# Altium project MiniPTM.PrjPcb
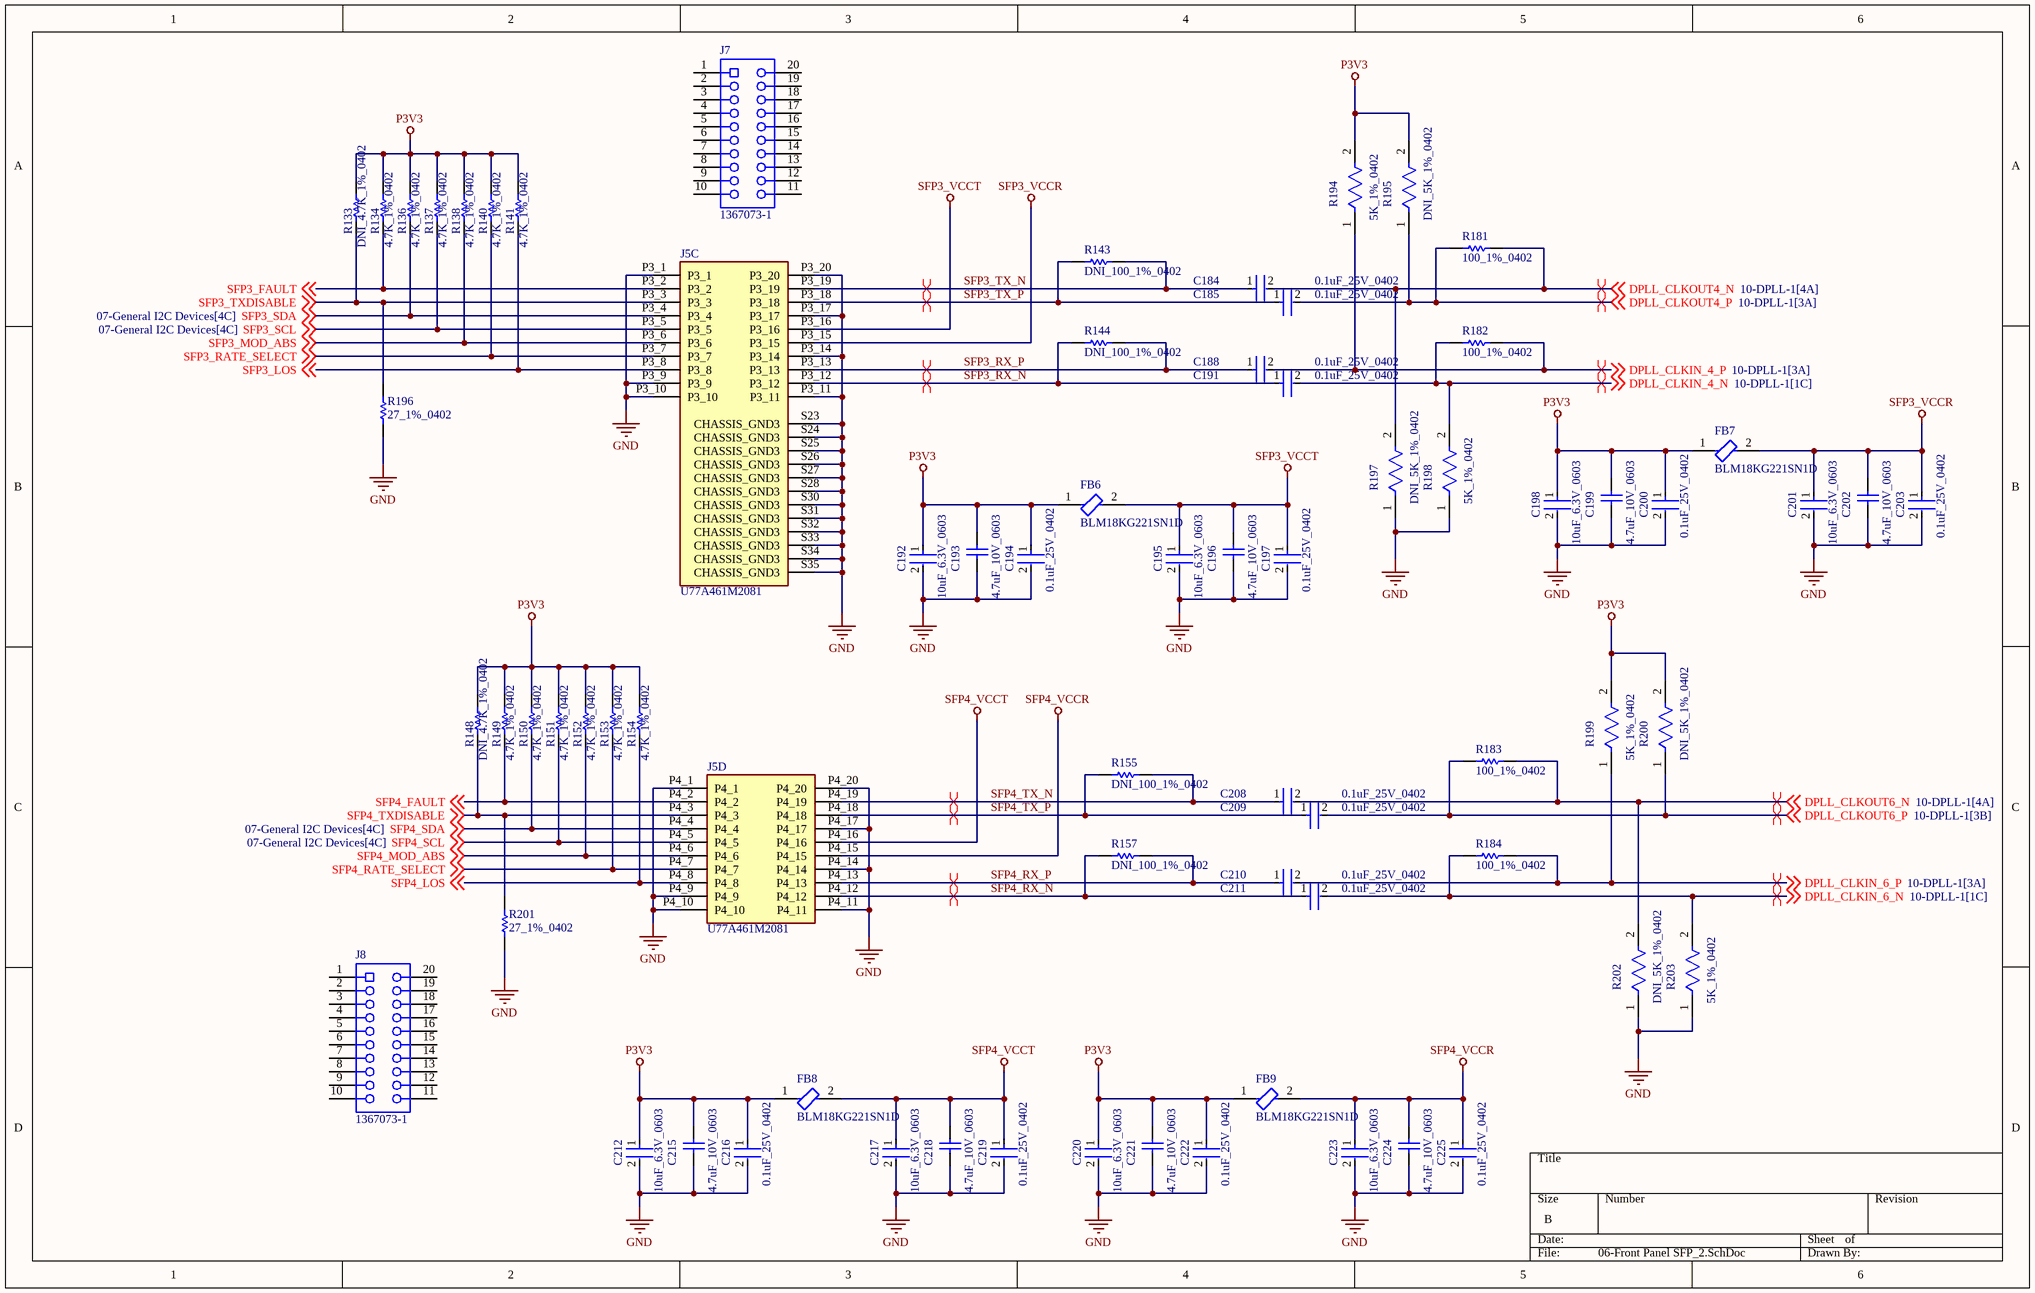
[diagram p0: 06-Front Panel SFP_2.SchDoc]
ProjectDate: 09/14/21; ProjectRevision: P3
3 sheets, 118 parts. Net scope: global (net labels, ports and power ports of the same name join across sheets).
Board file: MiniPTM.PcbDoc
Sheets:
  06-Front Panel SFP_2.SchDoc
  07-General I2C Devices.SchDoc
  13-Power-P3V3.SchDoc

## Sheet 06-Front Panel SFP_2.SchDoc
size B; SheetNumber: 5; SheetTotal: 15

### Parts
C184  0.1uF_25V_0402  [FP-0402-L_1_0_1-W_0_5_0_1-IPC_C]
C185  0.1uF_25V_0402  [FP-0402-L_1_0_1-W_0_5_0_1-IPC_C]
C188  0.1uF_25V_0402  [FP-0402-L_1_0_1-W_0_5_0_1-IPC_C]
C191  0.1uF_25V_0402  [FP-0402-L_1_0_1-W_0_5_0_1-IPC_C]
C192  10uF_6.3V_0603  [FP-C0603C106M9PACTU-MFG]
C193  4.7uF_10V_0603  [CAPC1608X87X35NL15T15]
C194  0.1uF_25V_0402  [FP-0402-L_1_0_1-W_0_5_0_1-IPC_C]
C195  10uF_6.3V_0603  [FP-C0603C106M9PACTU-MFG]
C196  4.7uF_10V_0603  [CAPC1608X87X35NL15T15]
C197  0.1uF_25V_0402  [FP-0402-L_1_0_1-W_0_5_0_1-IPC_C]
C198  10uF_6.3V_0603  [FP-C0603C106M9PACTU-MFG]
C199  4.7uF_10V_0603  [CAPC1608X87X35NL15T15]
C200  0.1uF_25V_0402  [FP-0402-L_1_0_1-W_0_5_0_1-IPC_C]
C201  10uF_6.3V_0603  [FP-C0603C106M9PACTU-MFG]
C202  4.7uF_10V_0603  [CAPC1608X87X35NL15T15]
C203  0.1uF_25V_0402  [FP-0402-L_1_0_1-W_0_5_0_1-IPC_C]
C208  0.1uF_25V_0402  [FP-0402-L_1_0_1-W_0_5_0_1-IPC_C]
C209  0.1uF_25V_0402  [FP-0402-L_1_0_1-W_0_5_0_1-IPC_C]
C210  0.1uF_25V_0402  [FP-0402-L_1_0_1-W_0_5_0_1-IPC_C]
C211  0.1uF_25V_0402  [FP-0402-L_1_0_1-W_0_5_0_1-IPC_C]
C212  10uF_6.3V_0603  [FP-C0603C106M9PACTU-MFG]
C215  4.7uF_10V_0603  [CAPC1608X87X35NL15T15]
C216  0.1uF_25V_0402  [FP-0402-L_1_0_1-W_0_5_0_1-IPC_C]
C217  10uF_6.3V_0603  [FP-C0603C106M9PACTU-MFG]
C218  4.7uF_10V_0603  [CAPC1608X87X35NL15T15]
C219  0.1uF_25V_0402  [FP-0402-L_1_0_1-W_0_5_0_1-IPC_C]
C220  10uF_6.3V_0603  [FP-C0603C106M9PACTU-MFG]
C221  4.7uF_10V_0603  [CAPC1608X87X35NL15T15]
C222  0.1uF_25V_0402  [FP-0402-L_1_0_1-W_0_5_0_1-IPC_C]
C223  10uF_6.3V_0603  [FP-C0603C106M9PACTU-MFG]
C224  4.7uF_10V_0603  [CAPC1608X87X35NL15T15]
C225  0.1uF_25V_0402  [FP-0402-L_1_0_1-W_0_5_0_1-IPC_C]
FB6  BLM18KG221SN1D  [FP-BLM18-0_15-t0_8-IPC_B]
FB7  BLM18KG221SN1D  [FP-BLM18-0_15-t0_8-IPC_B]
FB8  BLM18KG221SN1D  [FP-BLM18-0_15-t0_8-IPC_B]
FB9  BLM18KG221SN1D  [FP-BLM18-0_15-t0_8-IPC_B]
J5  U77A461M2081  [AMPHENOL_U77A461M2081]  (parts C,D of 4)
J7  1367073-1  [TECO-1367073-1_V]
J8  1367073-1  [TECO-1367073-1_V]
R133  DNI_4.7K_1%_0402  [RESC1005X40X25NL10T10]  (no BOM)
R134  4.7K_1%_0402  [RESC1005X40X25NL10T10]
R136  4.7K_1%_0402  [RESC1005X40X25NL10T10]
R137  4.7K_1%_0402  [RESC1005X40X25NL10T10]
R138  4.7K_1%_0402  [RESC1005X40X25NL10T10]
R140  4.7K_1%_0402  [RESC1005X40X25NL10T10]
R141  4.7K_1%_0402  [RESC1005X40X25NL10T10]
R143  DNI_100_1%_0402  [RESC1005X40X25NL05T10]  (no BOM)
R144  DNI_100_1%_0402  [RESC1005X40X25NL05T10]  (no BOM)
R148  DNI_4.7K_1%_0402  [RESC1005X40X25NL10T10]  (no BOM)
R149  4.7K_1%_0402  [RESC1005X40X25NL10T10]
R150  4.7K_1%_0402  [RESC1005X40X25NL10T10]
R151  4.7K_1%_0402  [RESC1005X40X25NL10T10]
R152  4.7K_1%_0402  [RESC1005X40X25NL10T10]
R153  4.7K_1%_0402  [RESC1005X40X25NL10T10]
R154  4.7K_1%_0402  [RESC1005X40X25NL10T10]
R155  DNI_100_1%_0402  [RESC1005X40X25NL05T10]  (no BOM)
R157  DNI_100_1%_0402  [RESC1005X40X25NL05T10]  (no BOM)
R181  100_1%_0402  [RESC1005X40X25NL05T10]
R182  100_1%_0402  [RESC1005X40X25NL05T10]
R183  100_1%_0402  [RESC1005X40X25NL05T10]
R184  100_1%_0402  [RESC1005X40X25NL05T10]
R194  5K_1%_0402  [FP-RC0402-MFG]
R195  DNI_5K_1%_0402  [FP-RC0402-MFG]  (no BOM)
R196  27_1%_0402  [RESC1005X40X25NL05T05]
R197  DNI_5K_1%_0402  [FP-RC0402-MFG]  (no BOM)
R198  5K_1%_0402  [FP-RC0402-MFG]
R199  5K_1%_0402  [FP-RC0402-MFG]
R200  DNI_5K_1%_0402  [FP-RC0402-MFG]  (no BOM)
R201  27_1%_0402  [RESC1005X40X25NL05T05]
R202  DNI_5K_1%_0402  [FP-RC0402-MFG]  (no BOM)
R203  5K_1%_0402  [FP-RC0402-MFG]

### Nets
GND: C192.2 C193.1 C194.2 C195.2 C196.1 C197.2 C198.2 C199.1 C200.2 C201.2 C202.1 C203.2 C212.2 C215.1 C216.2 C217.2 C218.1 C219.2 C220.2 C221.1 C222.2 C223.2 C224.1 C225.2 J5.P3_1 J5.P3_9 J5.P3_10 J5.P3_11 J5.P3_14 J5.P3_17 J5.P3_20 J5.P4_1 J5.P4_9 J5.P4_10 J5.P4_11 J5.P4_14 J5.P4_17 J5.P4_20 J5.S23(CHASSIS_GND3) J5.S24(CHASSIS_GND3) J5.S25(CHASSIS_GND3) J5.S26(CHASSIS_GND3) J5.S27(CHASSIS_GND3) J5.S28(CHASSIS_GND3) J5.S30(CHASSIS_GND3) J5.S31(CHASSIS_GND3) J5.S32(CHASSIS_GND3) J5.S33(CHASSIS_GND3) J5.S34(CHASSIS_GND3) J5.S35(CHASSIS_GND3) R196.1 R197.1 R198.1 R201.1 R202.1 R203.1
P3V3: C192.1 C193.2 C194.1 C198.1 C199.2 C200.1 C212.1 C215.2 C216.1 C220.1 C221.2 C222.1 FB6.1 FB7.1 FB8.1 FB9.1 R133.1 R134.1 R136.1 R137.1 R138.1 R140.1 R141.1 R148.1 R149.1 R150.1 R151.1 R152.1 R153.1 R154.1 R194.2 R195.2 R199.2 R200.2
SFP3_VCCR: C201.1 C202.2 C203.1 FB7.2 J5.P3_15
SFP3_VCCT: C195.1 C196.2 C197.1 FB6.2 J5.P3_16
SFP4_VCCR: C223.1 C224.2 C225.1 FB9.2 J5.P4_15
SFP4_VCCT: C217.1 C218.2 C219.1 FB8.2 J5.P4_16
DPLL_CLKIN_4_N: C191.2 R182.1 R198.2 ; off-sheet DPLL_CLKIN_4_N
DPLL_CLKIN_4_P: C188.2 R182.2 R194.1 ; off-sheet DPLL_CLKIN_4_P
DPLL_CLKIN_6_N: C211.2 R184.1 R203.2 ; off-sheet DPLL_CLKIN_6_N
DPLL_CLKIN_6_P: C210.2 R184.2 R199.1 ; off-sheet DPLL_CLKIN_6_P
DPLL_CLKOUT4_N: C184.2 R181.2 R197.2 ; off-sheet DPLL_CLKOUT4_N
DPLL_CLKOUT4_P: C185.2 R181.1 R195.1 ; off-sheet DPLL_CLKOUT4_P
DPLL_CLKOUT6_N: C208.2 R183.2 R202.2 ; off-sheet DPLL_CLKOUT6_N
DPLL_CLKOUT6_P: C209.2 R183.1 R200.1 ; off-sheet DPLL_CLKOUT6_P
SFP3_FAULT: J5.P3_2 R134.2 ; off-sheet SFP3_FAULT
SFP3_LOS: J5.P3_8 R141.2 ; off-sheet SFP3_LOS
SFP3_MOD_ABS: J5.P3_6 R138.2 ; off-sheet SFP3_MOD_ABS
SFP3_RATE_SELECT: J5.P3_7 R140.2 ; off-sheet SFP3_RATE_SELECT
SFP3_RX_N: C191.1 J5.P3_12 R144.1
SFP3_RX_P: C188.1 J5.P3_13 R144.2
SFP3_SCL: J5.P3_5 R137.2 ; off-sheet SFP3_SCL
SFP3_SDA: J5.P3_4 R136.2 ; off-sheet SFP3_SDA
SFP3_TX_N: C184.1 J5.P3_19 R143.2
SFP3_TX_P: C185.1 J5.P3_18 R143.1
SFP3_TXDISABLE: J5.P3_3 R133.2 R196.2 ; off-sheet SFP3_TXDISABLE
SFP4_FAULT: J5.P4_2 R149.2 ; off-sheet SFP4_FAULT
SFP4_LOS: J5.P4_8 R154.2 ; off-sheet SFP4_LOS
SFP4_MOD_ABS: J5.P4_6 R152.2 ; off-sheet SFP4_MOD_ABS
SFP4_RATE_SELECT: J5.P4_7 R153.2 ; off-sheet SFP4_RATE_SELECT
SFP4_RX_N: C211.1 J5.P4_12 R157.1
SFP4_RX_P: C210.1 J5.P4_13 R157.2
SFP4_SCL: J5.P4_5 R151.2 ; off-sheet SFP4_SCL
SFP4_SDA: J5.P4_4 R150.2 ; off-sheet SFP4_SDA
SFP4_TX_N: C208.1 J5.P4_19 R155.2
SFP4_TX_P: C209.1 J5.P4_18 R155.1
SFP4_TXDISABLE: J5.P4_3 R148.2 R201.2 ; off-sheet SFP4_TXDISABLE

Not connected (* = marked no-connect by the designer): J7 1 2 3 4 5 6 7 8 9 10 11 12 13 14 15 16 17 18 19 20; J8 1 2 3 4 5 6 7 8 9 10 11 12 13 14 15 16 17 18 19 20

### Layout directives
differential pair: DPLL_CLKIN_4_N, DPLL_CLKIN_4_P, DPLL_CLKIN_6_N, DPLL_CLKIN_6_P, DPLL_CLKOUT4_N, DPLL_CLKOUT4_P, DPLL_CLKOUT6_N, DPLL_CLKOUT6_P, SFP3_RX_N, SFP3_RX_P, SFP3_TX_N, SFP3_TX_P, SFP4_RX_N, SFP4_RX_P, SFP4_TX_N, SFP4_TX_P

### Library data of the parts
C184 C185 C188 C191 C194 C197 C200 C203 C208-C211 C216 C219 C222 C225 = CMP-2008-02519-2: General Purpose Ceramic Capacitor, 0402, 100nF, 10%, X7R, 15%, 25V; Package Quantity: 1; Capacitance: 100nF; Min Operating Temperature: -55°C; Voltage: 25V; Voltage Rating: 25V; Construction: Flat; Max Operating Temperature: 125°C; Radiation Hardening: No; Depth: 0.5mm; Thickness: 0.022inch; Voltage Rating (DC): 25V; Number of Pins: 2; Lead Free: Lead Free; Series: -; REACH SVHC: No SVHC; Length: 1mm; Dielectric: X7R; RoHS Compliant: Yes; Mount: Surface Mount; Packaging: Tape and Reel; Case/Package: 0402; Case Code (Imperial): 0402; Termination: SMD/SMT; Width: 0.02inch; Case Code (Metric): 1005; Tolerance: 10%
C192 C195 C198 C201 C212 C217 C220 C223 = CMP-2006-02285-3: CAP CER 10UF 6.3V X5R 0603; Manufacturer Part Number: C0603C106M9PACTU; Manufacturer: Kemet; Material: Ceramic; Temperature Coefficient: 15%; Tolerance: 20%; Category: Cap; Height: 0.9mm; Digikey Description: CAP CER 10UF 6.3V X5R 0603; Mouser Description: In a Pack of 10, KEMET 0603 (1608M) 10µF MLCC 6.3V dc ±20% SMD C0603C106M9PACTU; Voltage Rating: 6.3V; Device Class L2: Capacitors; Temperature Range Low: -55°C; Temperature Characteristic: X5R; ComponentLink2Description: Datasheet; Ipc Land Pattern Name: CAPC16080X80; ComponentLink2URL: http://www.kemet.com/Lists/ProductCatalog/Attachments/19/KEM_C1006_X5R_SMD.pdf; Capacitance: 10uF; Temperature Range High: +85°C; Device Class L3: Ceramic Capacitors; RoHS: TRUE; Automotive: No; Value: 10uF; Temperature: -55°C to +85°C; Device Class L1: Passive Components; Package: C0603C106M9PACTU; Lead Free: Yes; Octopart: https://octopart.com/c0603c106m9pactu-kemet-8375727
C193 C196 C199 C202 C215 C218 C221 C224 = CMP-2006-03238-1: Part Number: C0603C475K8PACTU; Manufacturer: Kemet
FB6-FB9 = CMP-0686-00556-7: Chip Ferrite Bead, 0603, 220Ω @ 100MHz, 0.05Ω, 25%, 2.2A; DC Resistance (DCR): 50mR; Number of Circuits: 1; Impedance: 220R; Current Rating: 2.2A; Material: Ferrite; Test Frequency: 100MHz; Depth: 0.8mm; Series: BLM18K; RoHS Compliant: Yes; Termination: SMD/SMT; Max Current Rating: 2.2A; Case Code (Metric): 1608; Radiation Hardening: No; Number of Pins: 2; Length: 1.6mm; Lead Free: Lead Free; Package Quantity: 1; Height: 0.8mm; Core Material: Ferrite; Inductor Type: FERRITE BEAD; Min Operating Temperature: -55°C; Case/Package: 0603; Case Code (Imperial): 0603; Number of Lines: 1; Packaging: Tape and Reel; REACH SVHC: No SVHC; Max Operating Temperature: 125°C; Military Standard: Not; DC Resistance-Max: 50mR; Width: 0.8mm; DC Current: 2.2A; Max DC Current: 2.2A; Tolerance: 25%; Weight: 7.1E-05oz
J5 = U77A461M2081: MF: AMPHENOL ICC / FCI; Package: None; Price: None; Value: *; MP: U77A461M2081; Availability: Unavailable
J7 J8 = CMP-2000-05488-1: Female Connector, Pitch 0.8 mm, 2 x 10 Position, Height 5.4 mm, -55 to 85 degC, RoHS, Tape and Reel; Manufacturer: TE Connectivity; Product Training Modules: HighSpeedPluggableI/OSolutions; 3D Model: 1367073-1.pdf; Connector Type: SFP; Other Names: A97430DKR; Mating Products: 516-2084-ND / -TXRXOPTICALSFF1.25GBDISCSI; Dynamic Catalog: SFPConnectors; Featured Product: HighSpeedPluggableI-OSolutions; Connector Style: Receptacle; Associated Product: A103997CT-ND / -CONNSFPCAGESINGLEW/OPIPE / A103997TR-ND / -CONNSFPCAGESINGLEW/OPIPE / 1367645-3-ND / -CONNCAGE&HEATSINKSGLPORTTIN / 1367645-2-ND / -CONNCAGE&HEATSINKSGLPORTTIN / 1888424-1-ND / -CONNCAGE1X2SFPENHANCEDEMI / 1367643-1-ND / -CONNCAGESNGLPORTDBLSIDETIN / 1489962-1-ND / -CONNSFPCAGESINGLEW/OPIPE / 1367645-1-ND / -CONNCAGE&HEATSINKSGLPORTTIN / A99375-ND / -CONNSFPCAGE1X4PIN-IN-PASTE / A97412CT-ND / -CONNSFPLOWERCAGEPCB / More...; Number of Positions: 20; Package Reference: 1367073-1; Package Description: Female Connector, Pitch 0.8 mm, 2 x 10 Position, Height 5.4 mm; RoHS Information: 1367073-1StatementofCompliance; Contact Finish: Gold; Datasheet URL: http://www.te.com/commerce/DocumentDelivery/DDEController?Action=showdoc&DocId=Customer+Drawing%7F1367073%7FK%7Fpdf%7FEnglish%7FENG_CD_1367073_K.pdf%7F1367073-1; Datasheet Version: Rev. K, 12/2012; Contact Finish Thickness: 15µin(0.38µm); Category: Connectors,Interconnects; Mounting Type: SurfaceMount,RightAngle; Mounting Technology: SurfaceMount; Packaging: Digi-Reel®; Manufacturer URL: http://www.te.com/; Family: PluggableConnectors; Standard Package: 1; Termination: Solder
R133 R134 R136-R138 R140 R141 R148-R154 = CMP-2002-05217-1: Manufacturer: Bourns; Part Number: CR0402-FX-4701GLF
R143 R144 R155 R157 R181-R184 = CMP-2002-07853-1: Manufacturer: Yageo; Part Number: RC0402FR-13100RL
R194 R195 R197-R200 R202 R203 = CMP-03412-013078-1: RES SMD 5K OHM 1% 1/16W 0402; Manufacturer: Yageo; Manufacturer Part Number: RC0402FR-075KL; Resistance: 5kΩ; Temperature Coefficient: 100ppm/°C; Power Rating: 0.0625W; Voltage Rating: 50V; Value: 5kΩ; Temperature Range Low: -55°C; Lead Free: Yes; RoHS: TRUE; Device Class L2: Resistors; Package: RC0402; Footprint Url: https://pccomponents.com/datasheets/YAGEO-20RESISTORS.PDF; Height: 0.4mm; ComponentLink2URL: http://www.yageo.com/documents/recent/PYu-RC_Group_51_RoHS_L_10.pdf; Temperature: -55°C to +155°C; Composition: Thick Film; Device Class L1: Passive Components; Series: RC_L; Ipc Land Pattern Name: RESC10050X35; Tolerance: 1%; Device Class L3: Chip SMD Resistors; Temperature Range High: +155°C; Category: Res; Automotive: No; Octopart: https://octopart.com/rc0402fr-075kl-yageo-25450038; Digikey Description: RES SMD 5K OHM 1% 1/16W 0402; ComponentLink2Description: Datasheet
R196 R201 = CMP-2002-08434-1: Part Number: CRCW040227R0FKED; Manufacturer: Vishay Dale

## Sheet 07-General I2C Devices.SchDoc
size B; SheetNumber: 6; SheetTotal: 14
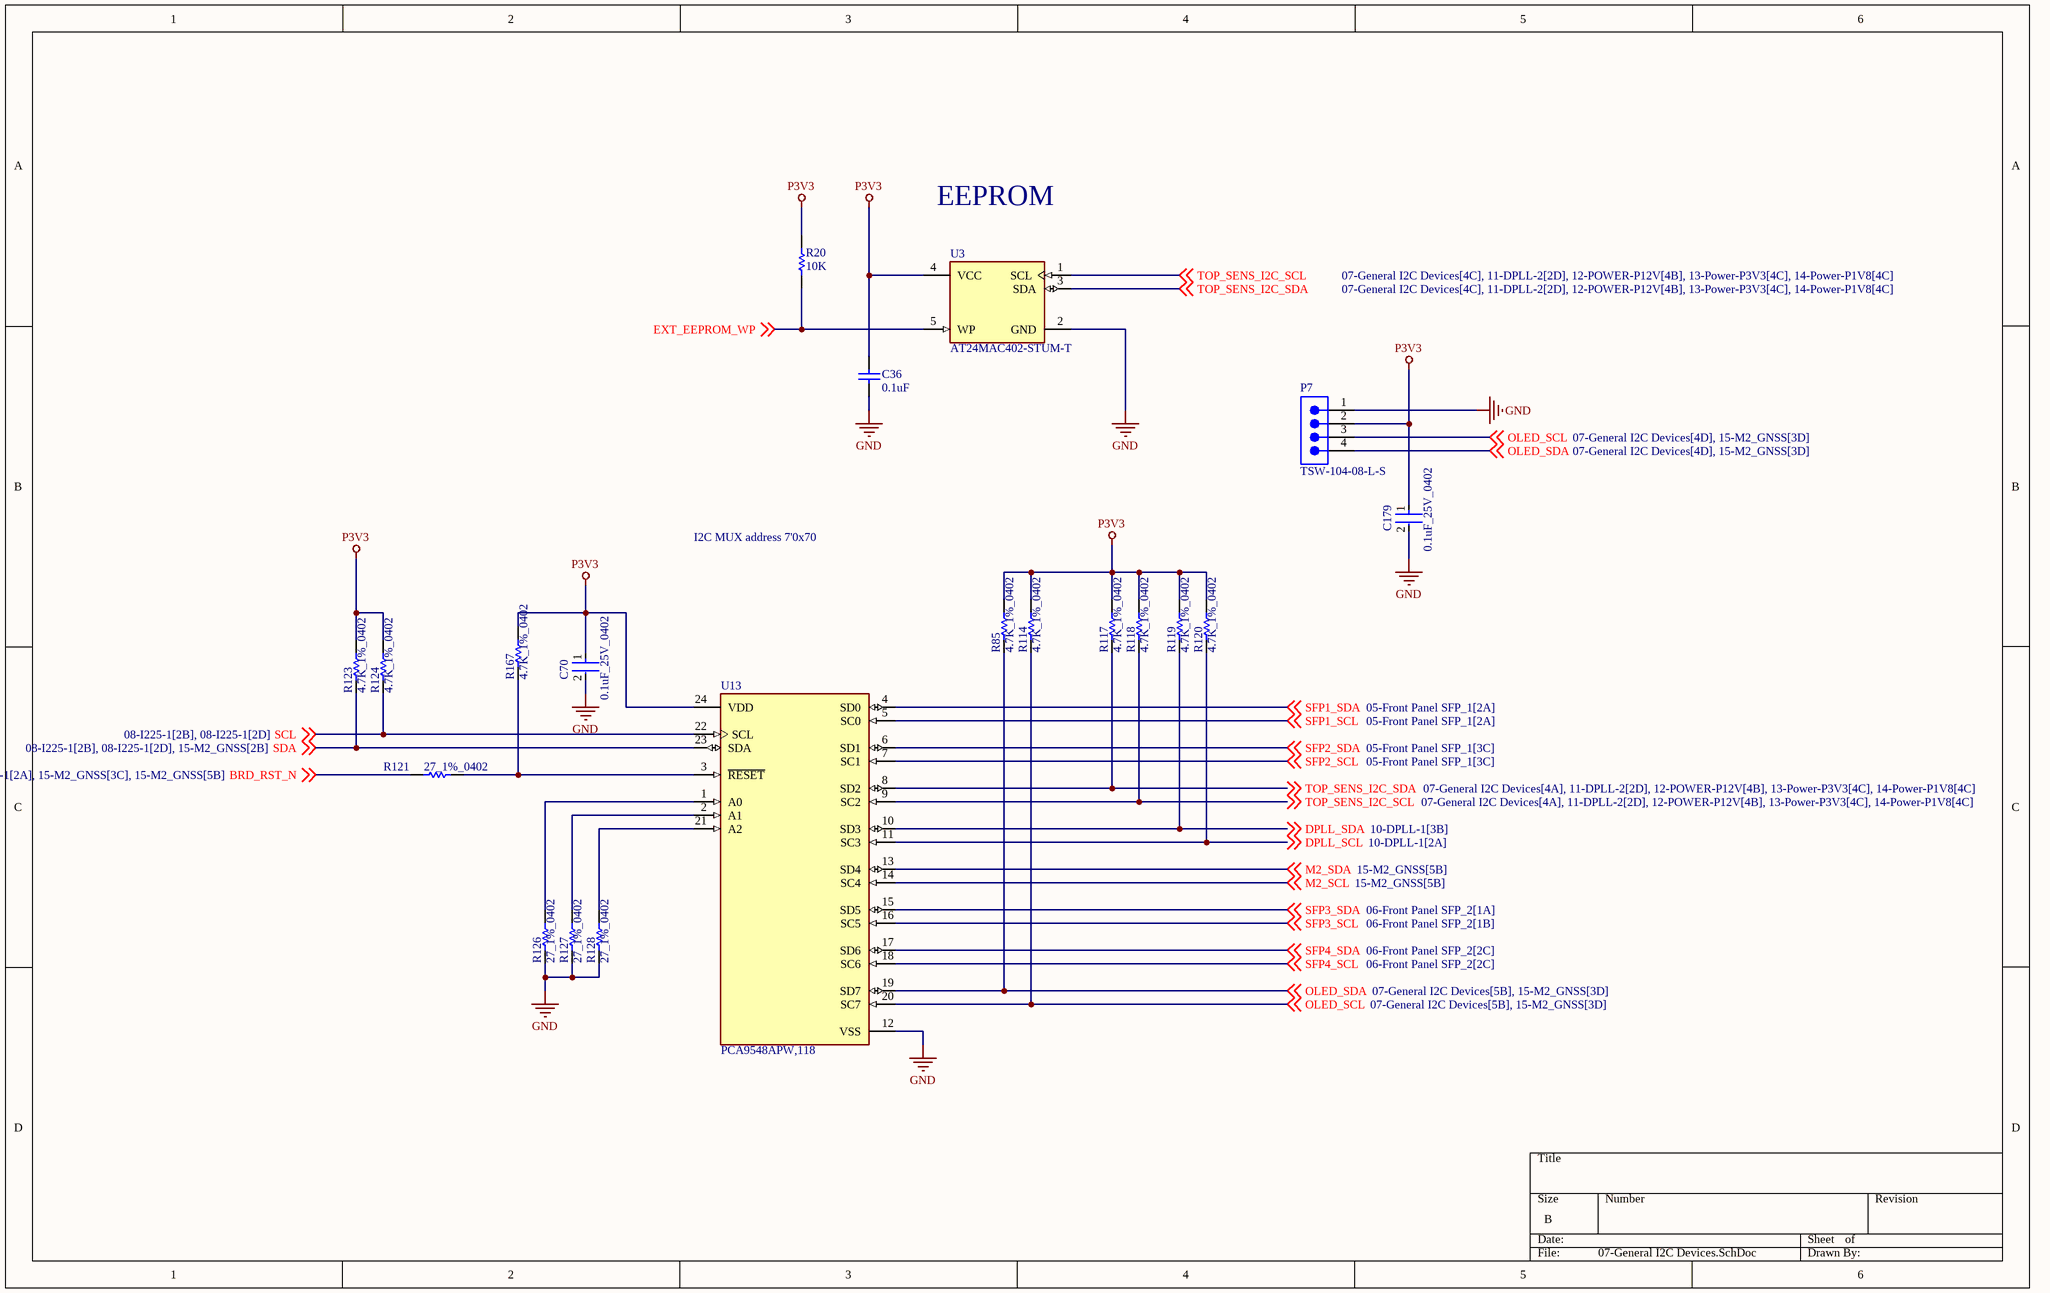
[diagram p1: 07-General I2C Devices.SchDoc]

### Parts
C36  0.1uF  [CAPC1608X87X45ML20T05]
C70  0.1uF_25V_0402  [FP-0402-L_1_0_1-W_0_5_0_1-IPC_C]
C179  0.1uF_25V_0402  [FP-0402-L_1_0_1-W_0_5_0_1-IPC_C]
P7  TSW-104-08-L-S  [SMTC-TSW-104-08-X-S]
R20  10K  [RESC1608X55X30LL15T20]
R85  4.7K_1%_0402  [RESC1005X40X25NL10T10]
R114  4.7K_1%_0402  [RESC1005X40X25NL10T10]
R117  4.7K_1%_0402  [RESC1005X40X25NL10T10]
R118  4.7K_1%_0402  [RESC1005X40X25NL10T10]
R119  4.7K_1%_0402  [RESC1005X40X25NL10T10]
R120  4.7K_1%_0402  [RESC1005X40X25NL10T10]
R121  27_1%_0402  [RESC1005X40X25NL05T05]
R123  4.7K_1%_0402  [RESC1005X40X25NL10T10]
R124  4.7K_1%_0402  [RESC1005X40X25NL10T10]
R126  27_1%_0402  [RESC1005X40X25NL05T05]
R127  27_1%_0402  [RESC1005X40X25NL05T05]
R128  27_1%_0402  [RESC1005X40X25NL05T05]
R167  4.7K_1%_0402  [RESC1005X40X25NL10T10]
U3  AT24MAC402-STUM-T  [FP-5TS1-IPC_C]
U13  PCA9548APW,118  [FP-SOT355-1-MFG]

### Nets
GND: C36.1 C70.2 C179.2 P7.1 R126.1 R127.1 R128.1 U3.2(GND) U13.12(VSS)
P3V3: C36.2 C70.1 C179.1 P7.2 R20.2 R85.2 R114.2 R117.2 R118.2 R119.2 R120.2 R123.2 R124.2 R167.2 U3.4(VCC) U13.24(VDD)
BRD_RST_N: R121.1 ; off-sheet BRD_RST_N
DPLL_SCL: R120.1 U13.11(SC3) ; off-sheet DPLL_SCL
DPLL_SDA: R119.1 U13.10(SD3) ; off-sheet DPLL_SDA
EXT_EEPROM_WP: R20.1 U3.5(WP) ; off-sheet EXT_EEPROM_WP
M2_SCL: U13.14(SC4) ; off-sheet M2_SCL
M2_SDA: U13.13(SD4) ; off-sheet M2_SDA
OLED_SCL: P7.3 R114.1 U13.20(SC7) ; off-sheet OLED_SCL
OLED_SDA: P7.4 R85.1 U13.19(SD7) ; off-sheet OLED_SDA
SCL: R124.1 U13.22(SCL) ; off-sheet SCL
SDA: R123.1 U13.23(SDA) ; off-sheet SDA
SFP1_SCL: U13.5(SC0) ; off-sheet SFP1_SCL
SFP1_SDA: U13.4(SD0) ; off-sheet SFP1_SDA
SFP2_SCL: U13.7(SC1) ; off-sheet SFP2_SCL
SFP2_SDA: U13.6(SD1) ; off-sheet SFP2_SDA
SFP3_SCL: U13.16(SC5) ; off-sheet SFP3_SCL
SFP3_SDA: U13.15(SD5) ; off-sheet SFP3_SDA
SFP4_SCL: U13.18(SC6) ; off-sheet SFP4_SCL
SFP4_SDA: U13.17(SD6) ; off-sheet SFP4_SDA
TOP_SENS_I2C_SCL: R118.1 U3.1(SCL) U13.9(SC2) ; off-sheet TOP_SENS_I2C_SCL
TOP_SENS_I2C_SDA: R117.1 U3.3(SDA) U13.8(SD2) ; off-sheet TOP_SENS_I2C_SDA
NetR121_2: R121.2 R167.1 U13.3(~{RESET})
NetR126_2: R126.2 U13.1(A0)
NetR127_2: R127.2 U13.2(A1)
NetR128_2: R128.2 U13.21(A2)

### Notes on the sheet
- EEPROM
- I2C MUX address 7'0x70

### Library data of the parts
C36 = CMP-2006-00003-1: C0603X104K5RACAUTO; Manufacturer: Kemet; Part Number: C0603X104K5RACAUTO
C70 C179 = CMP-2008-02519-2: as C184 on sheet 06-Front Panel SFP_2; Package Quantity: 1; Capacitance: 100nF; Min Operating Temperature: -55°C; Voltage: 25V; Voltage Rating: 25V; Construction: Flat; Max Operating Temperature: 125°C; Radiation Hardening: No; Depth: 0.5mm; Thickness: 0.022inch; Voltage Rating (DC): 25V; Number of Pins: 2; Lead Free: Lead Free; Series: -; REACH SVHC: No SVHC; Length: 1mm; Dielectric: X7R; RoHS Compliant: Yes; Mount: Surface Mount; Packaging: Tape and Reel; Case/Package: 0402; Case Code (Imperial): 0402; Termination: SMD/SMT; Width: 0.02inch; Case Code (Metric): 1005; Tolerance: 10%
P7 = CMP-1024-00358-1: 0.025" SQ Post Header, Through-hole, Vertical, -55 to 125 degC, 2.54 mm Pitch, 4-Pin, Male, RoHS; Manufacturer: Samtec; Pitch: 2.54 mm; PartNumber: TSW-104-08-L-S; RoHS: True; Temperature Range: -55 to 125 degC; PackageDescription: .025[0.64] SQ. Post Terminal Strip Assembly; Orientation: Vertical; ComponentLink2URL: http://www.samtec.com/documents/webfiles/pdf/TSW_TH.PDF; ComponentLink1Description: Manufacturer URL; ComponentLink2Description: Datasheet; PackageVersion: DM, 8/1988; ComponentLink3URL: http://www.samtec.com/documents/webfiles/cpdf/TSW-XXX-XX-XXX-X-XX-XXX-MKT.pdf; Mounting Technology: Through-hole; PackageReference: TSW-104-08-X-S; ComponentLink3Description: Package Specification; ComponentLink1URL: http://www.samtec.com; DatasheetVersion: F-214
R20 = CMP-2000-06990-1: Chip Resistor, 10 KOhm, +/- 1%, 0.1 W, -55 to 155 degC, 0603 (1608 Metric), RoHS, Tape and Reel RMCF0603FT10K0; Manufacturer: Stackpole-Electronics-Inc.; Temperature Coefficient: ±100ppm/°C; Power (Watts): 0.1W,1/10W; Package / Case: 0603(1608Metric); Datasheet Version: 01/2017; Resistance (Ohms): 10k; Features: AutomotiveAEC-Q200; Packaging: CutTape(CT); Series: RMCF; Height: 0.022"(0.55mm); Tolerance: ±1%; Manufacturer URL: https://www.seielect.com/; Datasheet URL: https://www.seielect.com/Catalog/SEI-RMCF_RMCP.pdf; Supplier Device Package: 0603; Number of Terminations: 2; Family: ChipResistor-SurfaceMount; Package Reference: 0603; Size / Dimension: 0.061"Lx0.031"W(1.55mmx0.80mm); Mounting Technology: SurfaceMount; Package Description: 2-Pin Surface Mount Device, Body 1.55 x 0.8 mm; Operating Temperature: -55°C~155°C; Composition: ThickFilm; Category: Resistors
R85 R114 R117-R120 R123 R124 R167 = CMP-2002-05217-1: as R133 on sheet 06-Front Panel SFP_2
R121 R126-R128 = CMP-2002-08434-1: as R196 on sheet 06-Front Panel SFP_2
U3 = CMP-06313-000011-1: IC EEPROM 2K I2C 1MHZ SOT23-5; Manufacturer: Microchip; Memory Size: 2Kbits; Min Supply Voltage: 1.7V; Max Supply Voltage: 5.5V; Frequency: 1000kHz; Standoff Height: 0mm; Nominal Supply Current: 0.4-2mA; Access Time: 0.55us; Interface: I2C,2-Wire; Temperature Range Low: -40°C; Height: 1mm; ComponentLink2URL: http://ww1.microchip.com/downloads/en/DeviceDoc/Atmel-8807-SEEPROM-AT24MAC402-602-Datasheet.pdf; Ipc Land Pattern Name: SOT95P280X100-5; Category: IC; Memory Type: EEPROM; Digikey Description: IC EEPROM 2K I2C 1MHZ SOT23-5; Manufacturer Part Number: AT24MAC402-STUM-T; Device Class L1: Integrated Circuits (ICs); Temperature Range High: +85°C; ComponentLink2Description: Datasheet; RoHS: TRUE; Mouser Description: EEPROM Serial-I2C 2K-bit 256 x 8 1.8V/2.5V/3.3V/5V 5-Pin SOT-23 T/R; Octopart: https://octopart.com/at24mac402-stum-t-microchip-77758112; Temperature: -40°C to +85°C; Package: 5TS1; Device Class L3: EEPROM; Automotive: No; Device Class L2: Memory; Lead Free: Yes
U13 = CMP-2000-06880-2: IC INTERFACE SPECIALIZED 24TSSOP; Power Dissipation: 400mW; Low Level Output Current: 9mA; Number of Channels: 16; Max Frequency: 400kHz; Number of Inputs: 8; Number of Outputs: 1; On-State Resistance: 24R; Interface: I2C; Turn-On Delay Time: 300ns; Logic Function: Multiplexer; Nominal Supply Current: 100mA; Operating Supply Current: 65uA; Min Supply Voltage: 2.3V; Propagation Delay: 0.3ns; Max Supply Voltage: 5.5V; Contact Plating: Gold; Max Power Dissipation: 400mW; Mount: Surface Mount; Package Quantity: 2500; Min Operating Temperature: -40°C; Max Operating Temperature: 85°C; Case/Package: TSSOP; Number of Pins: 24; Bandwidth: 400kHz; Quiescent Current: 65uA; Packaging: Tape and Reel; Lead Free: Lead Free; Turn-Off Delay Time: 300ns; Radiation Hardening: No

## Sheet 13-Power-P3V3.SchDoc
size B; SheetNumber: 12; SheetTotal: 15; SPICEModelCacheMBQUAUON: <root> / <DocumentId>MBQUAUON</DocumentId> / <CacheFrame Number="0"> / <Model Name="emk105bj105_v-f" Kind="CKT"> / <Text>* EMK105BJ105_V-F     SPICE MODEL  ( General Type ) / *-------------------------------------------------------------------------------------------------------- / * Model Generated by TAIYO YUDEN Corporation (http://www.ty-top.com) / * Version 1.0 / * TAIYO YUDEN Control No. 170508_130520 / * Copyright(c) 2012 TAIYO YUDEN CO.,LTD. All Rights Reserved. / *-------------------------------------------------------------------------------------------------------- / * / * Products Name : Multilayer Ceramic Capacitors / * / * Characteristics : / *     Capacitance : 1 uF , Rated Voltage : 16V , TCC : X5R / *     Case Size : 1.0 x 0.5 / 0.039 x 0.02 [mm/inch] , Thickness : 0.5 / 0.02 [mm/inch] / *     (Conditions: Temperature = 25 degC , DC Bias Current/Voltage = 0A / 0V) / * / * Frequency Range : 40Hz - 3GHz / * / * External Node Assignments : / * / *  1  o---| |---o  2 / * / *-------------------------------------------------------------------------------------------------------- / .SubCkt EMK105BJ105_V-F 1 2 / **************************** / C0 1 110 0.68309u / Cm 1 101 0.26053u / C1 101 102 0.94076u / Rc1 101 102 1.9029k / C2 102 103 0.66707u / Rc2 102 103 120.36 / C3 103 110 0.57203u / Rc3 103 110 2.1097 / C2m 1 301 0.1871u / C21 301 302 3.2494u / Rc21 301 302 1.1117k / C22 302 303 2.1014u / Rc22 302 303 1.484k / C23 303 304 2.1172u / Rc23 303 304 1.3876k / C24 304 305 0.75729u / Rc24 304 305 332.59 / C25 305 306 0.94401u / Rc25 305 306 249.09 / C26 306 307 0.34674u / Rc26 306 307 28.352 / C27 307 308 0.37158u / Rc27 307 308 19.989 / C28 308 309 0.17933u / Rc28 308 309 31.748 / C29 309 110 0.016445u / Rc29 309 110 1.0592 / Rp0 1 110 100Meg / L0 110 120 0.2216n / Lm 120 130 0.1509n / L1 120 121 0.12659n / RL1 121 130 0.85161 / L2 120 122 0.15996n / RL2 122 130 0.42469 / L3 120 123 7.9543n / RL3 123 130 0.54643m / CR 120 124 0.24334u / LR 124 125 0.090738n / RR 125 130 68.076m / CL 130 140 2.7354p / LL 130 140 0.10762n / RL 130 140 50.614 / Rs 140 2 7.5416m / **************************** / .ends EMK105BJ105_V-F</Text> / </Model> / </CacheFrame> / </root>
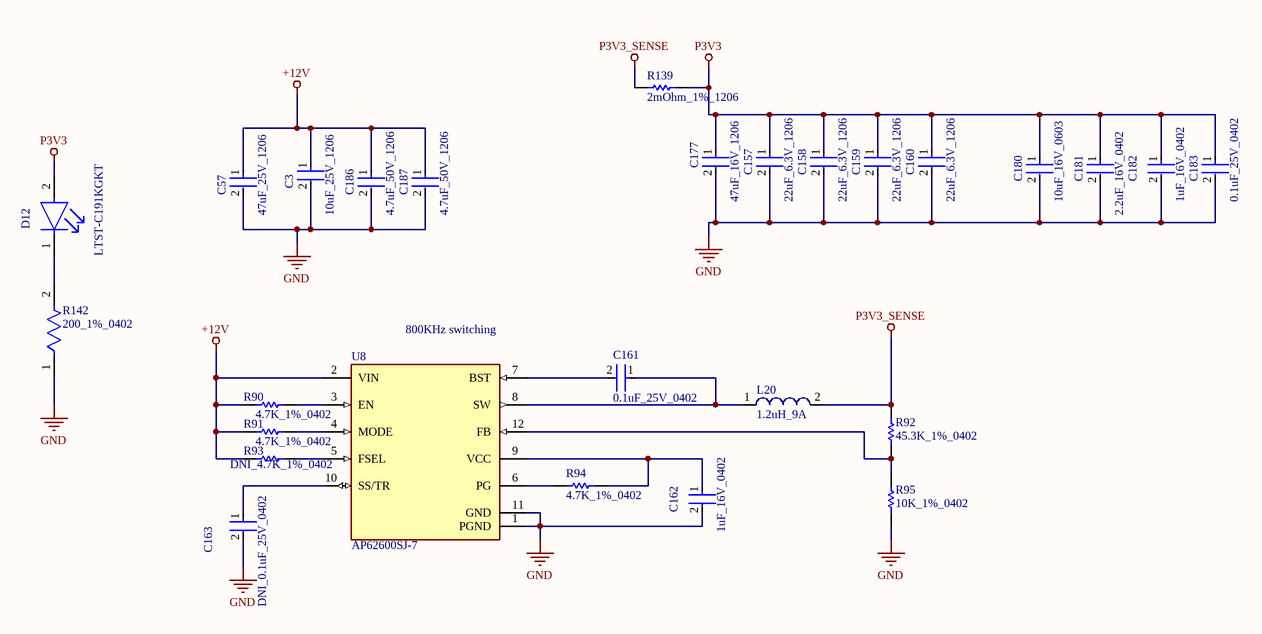
[diagram p2: 13-Power-P3V3.SchDoc]

### Parts
C3  10uF_25V_1206  [FP-1206-L_3_2_0_2-W_1_6_0-IPC_A]
C57  47uF_25V_1206  [FP-C3216-160-0_2-MFG]
C157  22uF_6.3V_1206  [FP-1206-L_3_2_0_2-W_1_6_0-IPC_C]
C158  22uF_6.3V_1206  [FP-1206-L_3_2_0_2-W_1_6_0-IPC_C]
C159  22uF_6.3V_1206  [FP-1206-L_3_2_0_2-W_1_6_0-IPC_C]
C160  22uF_6.3V_1206  [FP-1206-L_3_2_0_2-W_1_6_0-IPC_C]
C161  0.1uF_25V_0402  [FP-0402-L_1_0_1-W_0_5_0_1-IPC_C]
C162  1uF_16V_0402  [FP-0402-L_1_0_0_05-W_0_5-IPC_A]
C163  DNI_0.1uF_25V_0402  [FP-0402-L_1_0_1-W_0_5_0_1-IPC_C]  (no BOM)
C177  47uF_16V_1206  [FP-C3216-160-0_2-MFG]
C180  10uF_16V_0603  [FP-0603-L_1_6_0_2-W_0_8_0-MFG]
C181  2.2uF_16V_0402  [FP-C1005-050-0_05-IPC_A]
C182  1uF_16V_0402  [FP-0402-L_1_0_0_05-W_0_5-IPC_A]
C183  0.1uF_25V_0402  [FP-0402-L_1_0_1-W_0_5_0_1-IPC_C]
C186  4.7uF_50V_1206  [FP-GRM31C-0_2-e0_3_0_8-IPC_C]
C187  4.7uF_50V_1206  [FP-GRM31C-0_2-e0_3_0_8-IPC_C]
D12  LTST-C191KGKT  [FP-LTST-C191KGKT-MFG]
L20  1.2uH_9A  [WE-LHMI 7050]
R90  4.7K_1%_0402  [RESC1005X40X25NL10T10]
R91  4.7K_1%_0402  [RESC1005X40X25NL10T10]
R92  45.3K_1%_0402  [RESC1005X40X25ML05T10]
R93  DNI_4.7K_1%_0402  [RESC1005X40X25NL10T10]  (no BOM)
R94  4.7K_1%_0402  [RESC1005X40X25NL10T10]
R95  10K_1%_0402  [RESC1005X40X25NL10T10]
R139  2mOhm_1%_1206  [RESC3216X89X64NL25T25]
R142  200_1%_0402  [FP-ERJ2RK-IPC_A]
U8  AP62600SJ-7  [FP-V-QFN2030-12_Type_A-MFG]

### Nets
+12V: C3.1 C57.1 C186.1 C187.1 R90.1 R91.1 R93.1 U8.2(VIN)
GND: C3.2 C57.2 C157.2 C158.2 C159.2 C160.2 C162.2 C163.2 C177.2 C180.2 C181.2 C182.2 C183.2 C186.2 C187.2 R95.1 R142.1 U8.1(PGND) U8.11(GND)
P3V3: C157.1 C158.1 C159.1 C160.1 C177.1 C180.1 C181.1 C182.1 C183.1 D12.2(A) R139.2
P3V3_SENSE: L20.2 R92.2 R139.1
NetC161_1: C161.1 L20.1 U8.8(SW)
NetC161_2: C161.2 U8.7(BST)
NetC162_1: C162.1 R94.1 U8.9(VCC)
NetC163_1: C163.1 U8.10(SS/TR)
NetD12_1: D12.1(C) R142.2
NetR90_2: R90.2 U8.3(EN)
NetR91_2: R91.2 U8.4(MODE)
NetR92_1: R92.1 R95.2 U8.12(FB)
NetR93_2: R93.2 U8.5(FSEL)
NetR94_2: R94.2 U8.6(PG)

### Notes on the sheet
- (near U8) 800KHz switching

### Library data of the parts
C3 = CMP-04427-006943-1: General Purpose Ceramic Capacitor, 1206, 10uF, 20%, X5R, 15%, 25V; Dissipation Factor: 12.5%; Insulation Resistance: 10GR; Case Code (Imperial): 1206; Series: -; Construction: Flat; Termination: SMD/SMT; Case/Package: 1206; Dielectric: X5R; Width: 1.6mm; Max Operating Temperature: 85°C; Height: 0.07mm; Package Quantity: 1; Depth: 1.6mm; Voltage Rating: 25V; Capacitance: 10uF; RoHS Compliant: Yes; Mount: Surface Mount; Radiation Hardening: No; Voltage Rating (DC): 25V; Number of Pins: 2; Contact Plating: Tin; Min Operating Temperature: -55°C; Lead Free: Lead Free; Packaging: Tape and Reel; Tolerance: 20%; Case Code (Metric): 3216; Thickness: 0.07inch; Length: 3.2mm; REACH SVHC: No SVHC
C57 = CMP-2000-05397-3: Multilayer Ceramic Capacitors 47uF ±20% 25V X5R SMD 1206; Weight: 0.000571oz; Dielectric: X5R; Length: 0.126inch; Voltage Rating: 25V; Case/Package: 1206; Dielectric Material: Ceramic; Min Operating Temperature: -55°C; Lead Free: Lead Free; Packaging: Tape and Reel; Package Quantity: 1; Mount: Surface Mount; Depth: 1.6mm; REACH SVHC: No SVHC; Termination: SMD/SMT; Case Code (Imperial): 1206; Series: C; Resistor Type: Ceramic; Voltage: 25V; Width: 0.063inch; Height: 1.6mm; Tolerance: 20%; Capacitance: 47uF; Max Operating Temperature: 85°C; Voltage Rating (DC): 25V; RoHS Compliant: Yes; Thickness: 0.071inch; Case Code (Metric): 3216
C157-C160 = CMP-2000-05869-2: General Purpose Ceramic Capacitor, 1206, 22uF, 20%, X5R, 15%, 6.3V; Lead Free: Lead Free; Case Code (Metric): 3216; Case/Package: 1206; Depth: 1.6mm; Capacitance: 22uF; Length: 3.2mm; Series: -; Contact Plating: Tin; Tolerance: 20%; REACH SVHC: No SVHC; Radiation Hardening: No; RoHS Compliant: Yes; Termination: SMD/SMT; Voltage Rating: 6.3V; Packaging: Tape and Reel; Voltage: 6.3V; Mount: Surface Mount; Thickness: 0.07inch; Package Quantity: 1; Voltage Rating (DC): 6.3V; Case Code (Imperial): 1206; Construction: Flat; Dielectric: X5R; Number of Pins: 2; Min Operating Temperature: -55°C; Height: 0.07mm; Width: 0.063inch; Max Operating Temperature: 85°C
C161 C163 C183 = CMP-2008-02519-2: as C184 on sheet 06-Front Panel SFP_2; Package Quantity: 1; Capacitance: 100nF; Min Operating Temperature: -55°C; Voltage: 25V; Voltage Rating: 25V; Construction: Flat; Max Operating Temperature: 125°C; Radiation Hardening: No; Depth: 0.5mm; Thickness: 0.022inch; Voltage Rating (DC): 25V; Number of Pins: 2; Lead Free: Lead Free; Series: -; REACH SVHC: No SVHC; Length: 1mm; Dielectric: X7R; RoHS Compliant: Yes; Mount: Surface Mount; Packaging: Tape and Reel; Case/Package: 0402; Case Code (Imperial): 0402; Termination: SMD/SMT; Width: 0.02inch; Case Code (Metric): 1005; Tolerance: 10%
C162 C182 = CMP-14477-000104-2: None; Tolerance: 10%; Voltage Rating: 16V; Dielectric: X5R; Capacitance: 1uF; Packaging: Tape and Reel; Depth: 0.5mm; Mount: Surface Mount; Thickness: 0.022inch; Package Quantity: 1; Min Operating Temperature: -55°C; Series: M; Voltage Rating (DC): 16V; Termination: SMD/SMT; Case/Package: 0402; Number of Pins: 2; Case Code (Imperial): 0402; Length: 1mm; Halogen Free: Halogen Free; Case Code (Metric): 1005; Width: 0.02inch; RoHS Compliant: Yes; Radiation Hardening: No; Max Operating Temperature: 85°C; Height: 0.5mm; Construction: Flat
C177 = CMP-2000-07442-2: Multilayer Ceramic Capacitors 47uF ±20% 16V X5R SMD 1206; Resistor Type: Ceramic; Width: 0.063inch; Case Code (Imperial): 1206; Radiation Hardening: No; Thickness: 0.071inch; Dielectric: X5R; Weight: 0.000571oz; Termination: SMD/SMT; Dielectric Material: Ceramic; Min Operating Temperature: -55°C; Depth: 1.6mm; Case Code (Metric): 3216; Max Operating Temperature: 85°C; RoHS Compliant: Yes; REACH SVHC: No SVHC; Mount: Surface Mount; Lead Free: Lead Free; Height: 1.6mm; Length: 3.2mm; Tolerance: 20%; Voltage Rating (DC): 16V; Capacitance: 47uF; Package Quantity: 1; Construction: Flat; Packaging: Tape and Reel; Series: C; Case/Package: 1206; Voltage Rating: 16V
C180 = CMP-2000-06226-4: Multilayer Ceramic Capacitor 10uF 16V X5R 20% SMD 0603 T/R; Packaging: Tape and Reel; Construction: Flat; Height: 0.8mm; Max Operating Temperature: 85°C; Dielectric: X5R; Case Code (Metric): 1608; Voltage Rating (DC): 16V; Width: 0.031inch; Voltage Rating: 16V; Length: 0.063inch; RoHS Compliant: Yes; Halogen Free: Halogen Free; Case Code (Imperial): 0603; Capacitance: 10uF; Mount: Surface Mount; Thickness: 0.031inch; Tolerance: 20%; Min Operating Temperature: -55°C; Series: M; Termination: SMD/SMT; Case/Package: 0603; Package Quantity: 1
C181 = CMP-2000-05998-2: Multilayer Ceramic Capacitors 2.2μF ±10% 16V X5R SMD 0402; Capacitance: 2.2uF; REACH SVHC: No SVHC; Series: C; Termination: SMD/SMT; Case Code (Imperial): 0402; Depth: 0.5mm; Mount: Surface Mount; Width: 0.02inch; Package Quantity: 1; Dielectric Material: Ceramic; Length: 1mm; Packaging: Tape and Reel; Case Code (Metric): 1005; RoHS Compliant: Yes; Dielectric: X5R; Max Operating Temperature: 85°C; Lead Free: Lead Free; Weight: 2.3E-05oz; Thickness: 0.022inch; Voltage Rating (DC): 16V; Tolerance: 10%; Voltage Rating: 16V; Resistor Type: Ceramic; Height: 0.5mm; Case/Package: 0402; Min Operating Temperature: -55°C
C186 C187 = CMP-1037-04923-3: Chip Multilayer Ceramic Capacitors for General Purpose, 1206, 4.7uF, X7R, 15%, 10%, 50V; Height: 1.6mm; Voltage: 50V; Capacitance: 4.7uF; Lead Free: Lead Free; Max Operating Temperature: 125°C; Packaging: Tape and Reel; REACH SVHC: No SVHC; Voltage Rating: 50V; Mount: Surface Mount; Termination: SMD/SMT; Tolerance: 10%; Case/Package: 1206; Material: Ceramic; Depth: 1.6mm; Length: 3.2mm; Case Code (Metric): 3216; Voltage Rating (DC): 50V; Case Code (Imperial): 1206; Radiation Hardening: No; Width: 0.063inch; Thickness: 0.071inch; Package Quantity: 2000; Min Operating Temperature: -55°C; Dielectric: X7R
D12 = CMP-2000-05198-2: LED GREEN CLEAR SMD; Max Power Dissipation: 75mW; Forward Current: 30mA; Reverse Voltage: 5V; Lens Color: Colorless; Forward Voltage: 2V; Dominant Wavelength: 571nm; Number of LEDs: 1; Viewing Angle: 130°; Lens Style: Rectangular; Test Current: 20mA; Luminous Intensity: 35mcd; Wavelength: 574nm; Width: 0.8mm; Case Code (Imperial): 0603; Number of Pins: 2; Lead Free: Lead Free; Packaging: Tape and Reel; Package Quantity: 1; Min Operating Temperature: -55°C; Case/Package: 0603; Length: 1.6mm; Power Dissipation: 75mW; Depth: 0.8mm; Radiation Hardening: No; Mount: Surface Mount; Max Operating Temperature: 85°C; Color: Green; Power Rating: 75mW; Height: 0.55mm; Illumination Color: Green; Case Code (Metric): 1608; Lens Transparency: Clear; Number of Elements: 1
L20 = CMP-1353-00066-2: SMD Power Inductor WE-LHMI, L=1.2 µH; Manufacturer: Wuerth Elektronik; PartNumber: 74437349012; Inductance: 1.2 ÂµH; ComponentLink1Description: Manufacturer URL; ComponentLink2URL: http://katalog.we-online.de/kataloge/eisos/media/pdf/74437349012.pdf; ComponentLink1URL: http://www.we-online.com; PackageReference: WE-LHMI 7050; ComponentLink2Description: Datasheet
R90 R91 R93 R94 = CMP-2002-05217-1: as R133 on sheet 06-Front Panel SFP_2
R92 = CMP-2002-07692-1: Part Number: RC0402FR-0745K3L; Manufacturer: Yageo / Phycomp
R95 = CMP-2002-04694-1: Manufacturer: Bourns; Part Number: CR0402-FX-1002GLF
R139 = CMP-2003-04334-1: Manufacturer: Vishay Dale; Part Number: WSL12062L000FEA18
R142 = CMP-2002-00757-2: RES SMD 200 OHM 1% 1/10W 0402; Power Rating: 100mW; Voltage Rating (DC): 50V; Resistance: 200R; Temperature Coefficient: 100ppm/°C; RoHS Compliant: Yes; Packaging: Tape and Reel; Case Code (Metric): 1005; Package Quantity: 1; Contact Plating: Tin; Series: ERJ; Mount: Surface Mount; Lead Free: Lead Free; Min Operating Temperature: -55°C; Number of Terminations: 2; Max Power Dissipation: 100mW; Technology: THICK FILM; Voltage Rating: 50V; Case/Package: 0402; Width: 0.02inch; Termination: SMD/SMT; Military Standard: Not; Height: 0.35mm; Radiation Hardening: No; Resistance Tolerance: 1%; Length: 1mm; REACH SVHC: No SVHC; Construction: Rectangular; Depth: 0.5mm; Features: Automotive AEC-Q200; Resistor Type: Thick Film; Case Code (Imperial): 0402; Tolerance: 1%; Size Code: 0402; Max Operating Temperature: 155°C
U8 = CMP-12757-000022-1: DCDC CONV HV BUCK,V-QFN2030-12; RoHS Compliant: Yes

## Nets that join several sheets
GND: 06-Front Panel SFP_2 (56 pins), 07-General I2C Devices (9 pins), 13-Power-P3V3 (19 pins)
P3V3: 06-Front Panel SFP_2 (34 pins), 07-General I2C Devices (16 pins), 13-Power-P3V3 (11 pins)
SFP3_SCL: 06-Front Panel SFP_2 (J5.P3_5 R137.2), 07-General I2C Devices (U13.16)
SFP3_SDA: 06-Front Panel SFP_2 (J5.P3_4 R136.2), 07-General I2C Devices (U13.15)
SFP4_SCL: 06-Front Panel SFP_2 (J5.P4_5 R151.2), 07-General I2C Devices (U13.18)
SFP4_SDA: 06-Front Panel SFP_2 (J5.P4_4 R150.2), 07-General I2C Devices (U13.17)